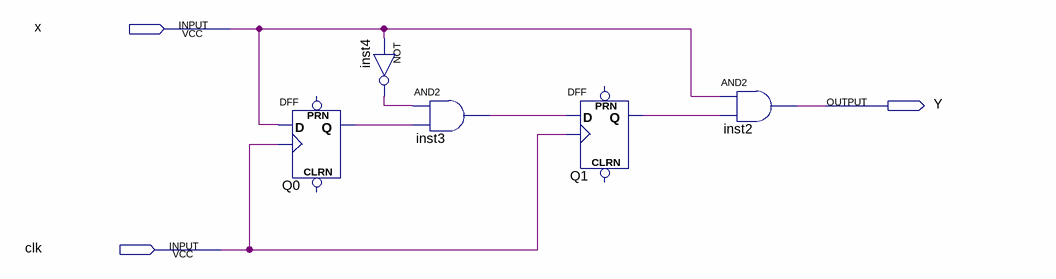
[diagram p0: schematic sheet]
// Quartus schematic Teste.bdf as structural Verilog: 5 symbols, 3 pins
module Teste (
  input  x,
  input  clk,
  output Y
);

  wire inst3_out, inst4_out, Q0_q, Q1_q;

  DFF Q0 (.CLK(clk), .D(x), .Q(Q0_q));  // open: CLRN, PRN
  not inst4 (inst4_out, x);
  and inst3 (inst3_out, inst4_out, Q0_q);
  DFF Q1 (.CLK(clk), .D(inst3_out), .Q(Q1_q));  // open: CLRN, PRN
  and inst2 (Y, x, Q1_q);
endmodule
